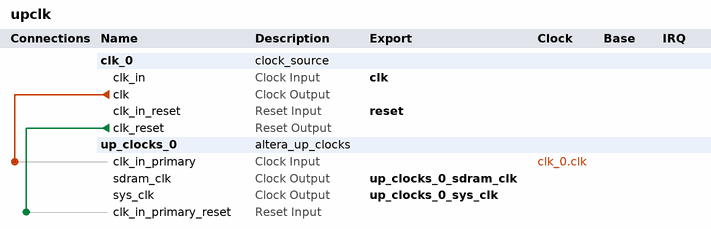
[diagram p0: system contents]
# Platform Designer (Qsys) system upclk, Cyclone II EP2C20F484C7
# Parameters at their usual value, and those the tool derives, are not listed.
package require -exact qsys 13.0
create_system upclk
set_project_property DEVICE_FAMILY {Cyclone II}
set_project_property DEVICE EP2C20F484C7

add_instance clk_0 clock_source 13.0
set_instance_parameter_value clk_0 clockFrequency 50000000

add_instance up_clocks_0 altera_up_clocks 13.0
set_instance_parameter_value up_clocks_0 board DE1
set_instance_parameter_value up_clocks_0 vga_clk false
set_instance_parameter_value up_clocks_0 audio_clk false
set_instance_parameter_value up_clocks_0 audio_clk_freq 12.288

# connections
add_connection clk_0.clk up_clocks_0.clk_in_primary clock
add_connection clk_0.clk_reset up_clocks_0.clk_in_primary_reset reset

# exported interfaces
add_interface clk clock sink
set_interface_property clk EXPORT_OF clk_0.clk_in
add_interface reset reset sink
set_interface_property reset EXPORT_OF clk_0.clk_in_reset
add_interface up_clocks_0_sdram_clk clock source
set_interface_property up_clocks_0_sdram_clk EXPORT_OF up_clocks_0.sdram_clk
add_interface up_clocks_0_sys_clk clock source
set_interface_property up_clocks_0_sys_clk EXPORT_OF up_clocks_0.sys_clk

set_interconnect_requirement {$system} qsys_mm.clockCrossingAdapter HANDSHAKE
set_interconnect_requirement {$system} qsys_mm.maxAdditionalLatency 1

save_system upclk.qsys
